# Altium schematic sheet ADC.SchDoc
size A
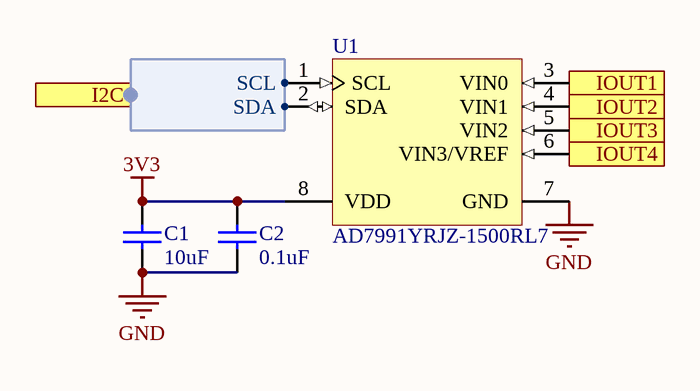
[diagram p0: ADC.SchDoc]

## Parts
C1  value 10uF  [C0402[1005X55]]  (hidden comment: 10uF 6.3V 0402)
C2  value 0.1uF  [C0402[1005X55]]  (hidden comment: 0.1uF 6.3V 0402)
U1  AD7991YRJZ-1500RL7  [RJ-8_M]

## Ports
I2C (harness I2C), IOUT1 (in), IOUT2 (in), IOUT3 (in), IOUT4 (in)

## Harnesses
I2C: SCL, SDA

## Nets
3V3: C1.2 C2.2 U1.8(VDD)
GND: C1.1 C2.1 U1.7(GND)
IOUT1: U1.3(VIN0) ; port IOUT1
IOUT2: U1.4(VIN1) ; port IOUT2
IOUT3: U1.5(VIN2) ; port IOUT3
IOUT4: U1.6(VIN3/VREF) ; port IOUT4
NetU1_1: U1.1(SCL) ; port I2C.SCL
NetU1_2: U1.2(SDA) ; port I2C.SDA

## Library data of the parts
C1 = CAP_10uF_6.3V_0402_20%: 10uF 6.3V 20% 0402 (1005 Metric); PartNumber: GRM155R60J106ME44D; Manufacturer: Murata; Mounting Technology: Surface Mount; PackageReference: 0402; PackageDescription: 0402 (1005 Metric); Voltage: 6.3V; Tolerance: 20%
C2 = CAP_0.1uF_6.3V_0402_10%: 0.1uF 6.3V 10% 0402 (1005 Metric); PartNumber: GRM155R70J104KA01D; Manufacturer: Murata; Mounting Technology: Surface Mount; PackageReference: 0402; PackageDescription: 0402 (1005 Metric); Voltage: 6.3V; Tolerance: 10%
U1 = CMP-0313-01614-2: Quad 12-Bit Analog-to-Digital Converter with I2C, Serial 2-Wire Interface, 140KSPS, -40 to +125 degC, RJ-8, Pb-Free, Reel; Generic Part Number: AD7991; Manufacturer: Analog Devices; Resolution (Bits): 12; Throughput Rate (SPS): 140K; Channels: 4; Interface: I2C/Ser 2-Wire; DatasheetVersion: Rev.B; ComponentLink1Description: Manufacturer URL; ComponentLink3Description: Package Specification; ComponentLink1URL: http://www.analog.com/en/index.html; ComponentLink2URL: http://www.analog.com/static/imported-files/data_sheets/AD7991_7995_7999.pdf; ComponentLink4Description: Product URL; Code_JEDEC: MO-178-BA; PartNumber: AD7991YRJZ-1500RL7; Mounting Technology: Surface Mount; PackageReference: RJ-8; PackageDescription: 8-Lead Thin Small Outline Transistor Package [SOT-23]; ComponentLink4URL: http://www.analog.com/en/analog-to-digital-converters/ad-converters/ad7991/products/product.html; Packing: Reel; PackageVersion: 121608-A; RoHS: Y; ComponentLink3URL: http://www.analog.com/static/imported-files/packages/PKG_PDF/SOT-23(RJ)/RJ_8.pdf; ComponentLink2Description: Datasheet